# EAGLE schematic pcb2 (EAGLE 9.3.0)
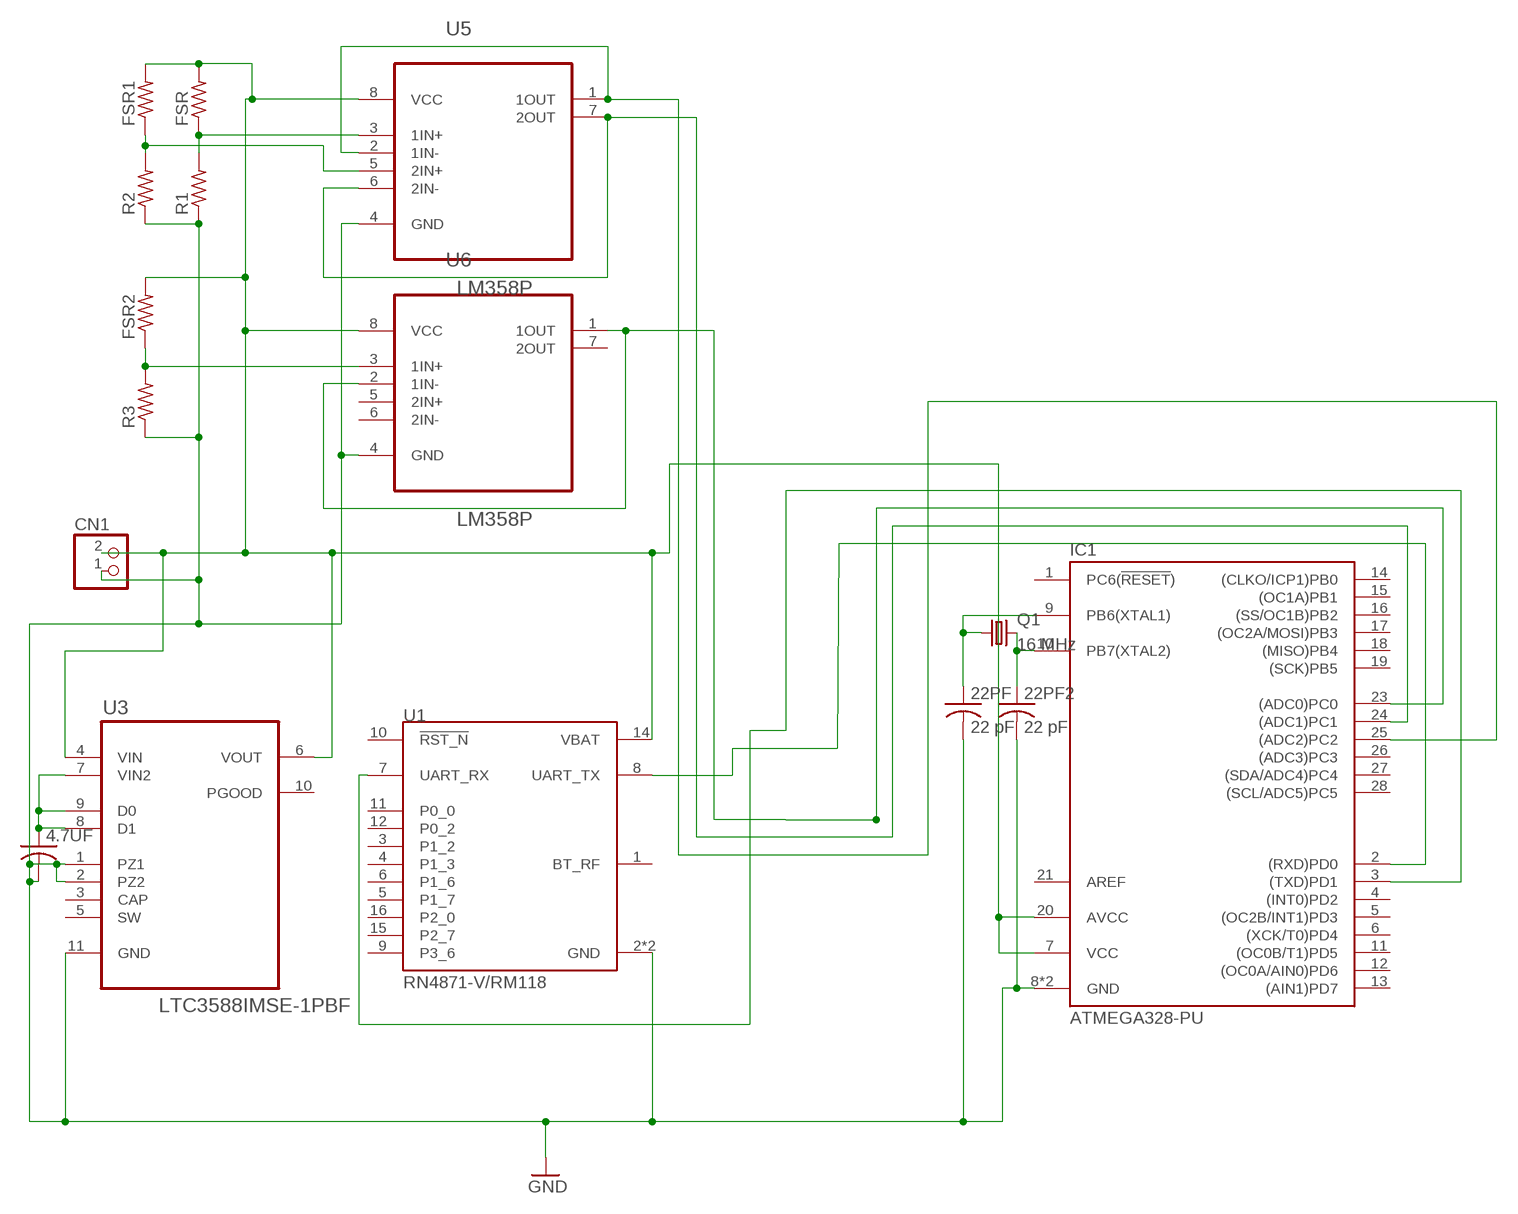
[diagram p0: schematic, sheet 1]

## Parts
4.7UF  C-US025-024X044  [C025-024X044]
22PF  22 pF  C-US025-024X044  [C025-024X044]
22PF2  22 pF  C-US025-024X044  [C025-024X044]
CN1  JST_2PIN-THM-RA  [JST-PH-2-THM-RA]
FSR  R-US_0204/5  [0204/5]
FSR1  R-US_0204/5  [0204/5]
FSR2  R-US_0204/5  [0204/5]
IC1  ATMEGA328-PU  [DIL28]
Q1  16 MHz  CRYSTALHC49U-V  [HC49U-V]
R1  R-US_0204/5  [0204/5]
R2  R-US_0204/5  [0204/5]
R3  R-US_0204/5  [0204/5]
U1  RN4871-V/RM118  [XCVR_RN4871-V/RM118]
U3  LTC3588IMSE-1PBF  [SOP50P490X110-11N]
U5  LM358P  [DIP254P762X508-8]
U6  LM358P  [DIP254P762X508-8]

## Nets
GND: 4.7UF.2 22PF2.2 22PF.2 CN1.1 IC1.8(GND) IC1.22(GND) R1.1 R2.1 R3.1 U1.2(GND) U1.13(GND) U3.1(PZ1) U3.2(PZ2) U3.11(GND) U5.4(GND) U6.4(GND)
N$2: IC1.3((TXD)PD1) U1.7(UART_RX)
N$3: IC1.2((RXD)PD0) U1.8(UART_TX)
N$5: FSR2.1 R3.2 U6.3(1IN+)
N$6: IC1.23((ADC0)PC0) U6.1(1OUT) U6.2(1IN-)
N$7: FSR.1 R1.2 U5.3(1IN+)
N$8: IC1.25((ADC2)PC2) U5.1(1OUT) U5.2(1IN-)
N$9: IC1.24((ADC1)PC1) U5.6(2IN-) U5.7(2OUT)
N$10: FSR1.1 R2.2 U5.5(2IN+)
N$11: 4.7UF.1 U3.7(VIN2) U3.8(D1) U3.9(D0)
N$12: 22PF.1 IC1.9(PB6(XTAL1)) Q1.1
N$13: 22PF2.1 IC1.10(PB7(XTAL2)) Q1.2
VCC: CN1.2 FSR1.2 FSR2.2 FSR.2 IC1.7(VCC) IC1.20(AVCC) U1.14(VBAT) U3.4(VIN) U3.6(VOUT) U5.8(VCC) U6.8(VCC)
Unconnected: IC1.1(PC6(!RESET!)) IC1.4((INT0)PD2) IC1.5((OC2B/INT1)PD3) IC1.6((XCK/T0)PD4) IC1.11((OC0B/T1)PD5) IC1.12((OC0A/AIN0)PD6) IC1.13((AIN1)PD7) IC1.14((CLKO/ICP1)PB0) IC1.15((OC1A)PB1) IC1.16((SS/OC1B)PB2) IC1.17((OC2A/MOSI)PB3) IC1.18((MISO)PB4) IC1.19((SCK)PB5) IC1.21(AREF) IC1.26((ADC3)PC3) IC1.27((SDA/ADC4)PC4) IC1.28((SCL/ADC5)PC5) U1.1(BT_RF) U1.3(P1_2) U1.4(P1_3) U1.5(P1_7) U1.6(P1_6) U1.9(P3_6) U1.10(!RST_N) U1.11(P0_0) U1.12(P0_2) U1.15(P2_7) U1.16(P2_0) U3.3(CAP) U3.5(SW) U3.10(PGOOD) U6.5(2IN+) U6.6(2IN-) U6.7(2OUT)

## Library data of the parts
4.7UF = rcl:C-US: CAPACITOR, American symbol; SPICEPREFIX: C
22PF 22PF2 = adafruit:C-US: CAPACITOR, American symbol
CN1 = adafruit:JST_2PIN: JST 2-Pin Connectors of various flavors SMT-RA (S2B-PH-SM4) 4UConnector #17311 SMT (B2B-PH-SM4) THM-RA (S2B-PH) THM (B2B-PH)
FSR FSR1 FSR2 R1-R3 = rcl:R-US_: RESISTOR, American symbol; SPICEPREFIX: R
IC1 = ATMEGA328-PU:ATMEGA328-PU: Atmel ATmega48/88/168/328 AVR Microcontroller; AVAILABILITY: Unavailable; DESCRIPTION: ATmega Series 20 MHz 32 KB Flash 2 KB SRAM 8-Bit Microcontroller - DIP-28; MF: Microchip; MP: ATMEGA328-PU; PACKAGE: PDIP-28 Microchip; PRICE: None
Q1 = adafruit:CRYSTAL: CRYSTAL; OC_FARNELL: 1666969; OC_NEWARK: unknown
U1 = RN4871-V_RM118:RN4871-V/RM118: Bluetooth 4.2 BLE Module Shielded Antenna ASCII Interface 9x11.5mm; DESCRIPTION: Bluetooth 4.2 BLE Module Shielded Antenna ASCII Interface 9x11.5mm; DIGI-KEY_PART_NUMBER: RN4871-V/RM118-ND; DIGI-KEY_PURCHASE_URL: https://www.digikey.com/product-detail/en/microchip-technology/RN4871-V-RM118/RN4871-V-RM118-ND/6130476?utm_source=snapeda&utm_medium=aggregator&utm_campaign=symbol; MF: Microchip; MP: RN4871-V/RM118; PACKAGE: SMD-16 Microchip
U3 = LTC3588IMSE-1PBF:LTC3588IMSE-1PBF: Piezoelectric Energy Harvesting Power Supply; DESCRIPTION: Piezoelectric Energy Harvesting Power Supply 10-Pin MSOP EP; DIGI-KEY_PART_NUMBER: LTC3588IMSE-1#PBF-ND; DIGI-KEY_PURCHASE_URL: https://www.digikey.com/product-detail/en/linear-technology-analog-devices/LTC3588IMSE-1-PBF/LTC3588IMSE-1-PBF-ND/2213930?utm_source=snapeda&utm_medium=aggregator&utm_campaign=symbol; MF: Linear Technology/Analog; MP: LTC3588IMSE-1#PBF; PACKAGE: MSOP-10 Linear Technology
U5 U6 = LM358P:LM358P: OPERATIONAL AMPLIFIERS; AVAILABILITY: Unavailable; DESCRIPTION: OP Amp Dual GP Â±16V/32V 8-Pin PDIP OP Amp Dual GP Â±16V/32V 8-Pin PDIP; MF: Texas Instruments; MP: LM358P; PACKAGE: SO-8 Texas Instruments; PRICE: None